# EAGLE design ARDUINO POWER UNIT1 (EAGLE 7.6.0)
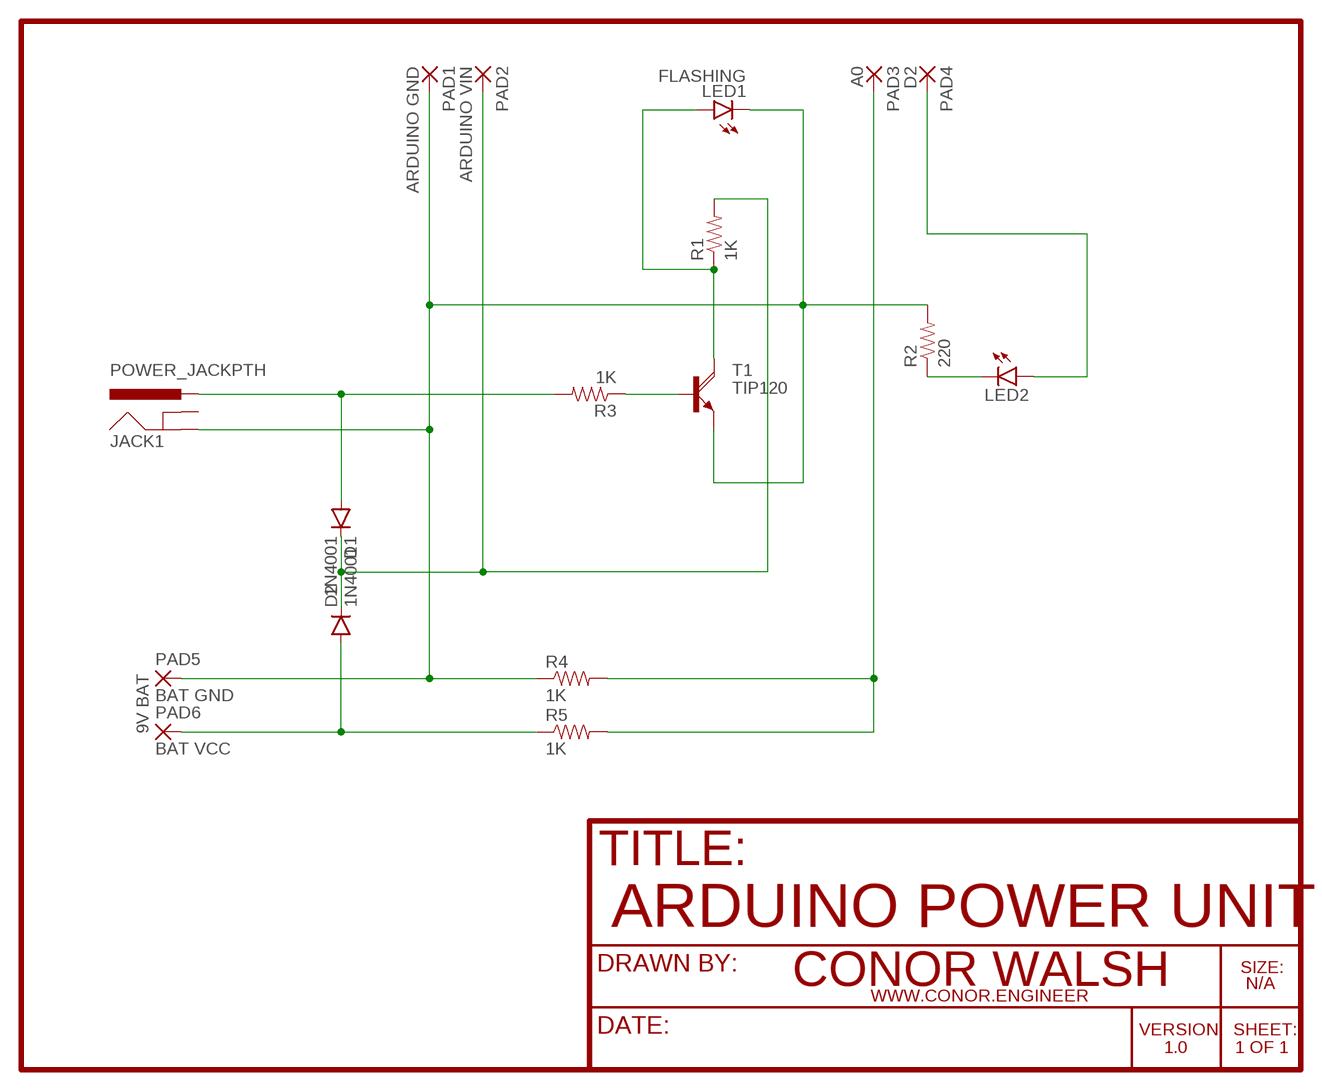
[diagram p0: schematic, sheet 1]

## Parts
D1  1N4001  DIODE1N4148  [DIODE-1N4148]
D2  1N4001  DIODE1N4148  [DIODE-1N4148]
JACK1  POWER_JACKPTH  [POWER_JACK_PTH]
LED1  FLASHING  LED5MM  [LED5MM]
LED2  LED5MM  [LED5MM]
PAD1  ARDUINO GND  2,54/0,9  [2,54/0,9]
PAD2  ARDUINO VIN  2,54/0,9  [2,54/0,9]
PAD3  A0  2,54/0,9  [2,54/0,9]
PAD4  D2  2,54/0,9  [2,54/0,9]
PAD5  BAT GND  2,54/0,9  [2,54/0,9]
PAD6  BAT VCC  2,54/0,9  [2,54/0,9]
R1  1K  RESISTORPTH-1/4W  [AXIAL-0.4]
R2  220  RESISTORPTH-1/4W  [AXIAL-0.4]
R3  1K  RESISTORPTH-1/4W  [AXIAL-0.4]
R4  1K  RESISTORPTH-1/4W  [AXIAL-0.4]
R5  1K  RESISTORPTH-1/4W  [AXIAL-0.4]
T1  TIP120  [TO220AH]

## Nets
N$1: D1.A JACK1.PWR R3.P$2
N$2: PAD3.1(P) R4.P$2 R5.P$2
N$3: R3.P$1 T1.B
N$4: LED1.A R1.P$1 T1.C
N$5: D2.A PAD6.1(P) R5.P$1
N$6: JACK1.GND LED1.K(C) PAD1.1(P) PAD5.1(P) R2.P$2 R4.P$1 T1.E
N$7: LED2.K(C) R2.P$1
N$8: LED2.A PAD4.1(P)
N$9: D1.C D2.C PAD2.1(P) R1.P$2
Unconnected: JACK1.GNDBREAK

## Notes on the sheet
- 9V BAT
- TITLE:
- ARDUINO POWER UNIT
- DRAWN BY: | SIZE:
- CONOR WALSH | N/A
- WWW.CONOR.ENGINEER
- DATE: | VERSION: | SHEET:
- 1.0 | 1 OF 1

## Library data of the parts
D1 D2 = SparkFun-DiscreteSemi:DIODE: Diode These are standard reverse protection diodes and small signal diodes. SMA package can handle up to about 1A. SOD-323 can handle about 200mA. What the SOD-323 package when ordering, there are some mfgs out there that are 5-pin packages.; PROD_ID: DIO-08378; VALUE: 1N4148
JACK1 = SparkFun-Connectors:POWER_JACK: Power Jack This is the standard 5.5mm barrel jack for power. The PTH is the most common, proven, reliable, footprint. The Slot footprint only works if the mill layer is transmitted to the PCB fab house so be warned. Mating wall wart : TOL-00298 (and others); PROD_ID: CONN-08197
LED1 LED2 = SparkFun-LED:LED: LEDs Standard schematic elements and footprints for 5mm, 3mm, 1206, and 0603 sized LEDs. 5mm - Spark Fun Electronics SKU : COM-00529 (and others)
PAD1-PAD6 = wirepad:2,54/0,9: THROUGH-HOLE PAD
R1-R5 = SparkFun-Resistors:RESISTOR: Resistor Basic schematic elements and footprints for 0603, 1206, and PTH resistors.
T1 = transistor-power:TIP120: NPN DARLINGTON TRANSISTOR

## Net classes
0 default: width 0.813 mm, clearance 0.813 mm

## Board
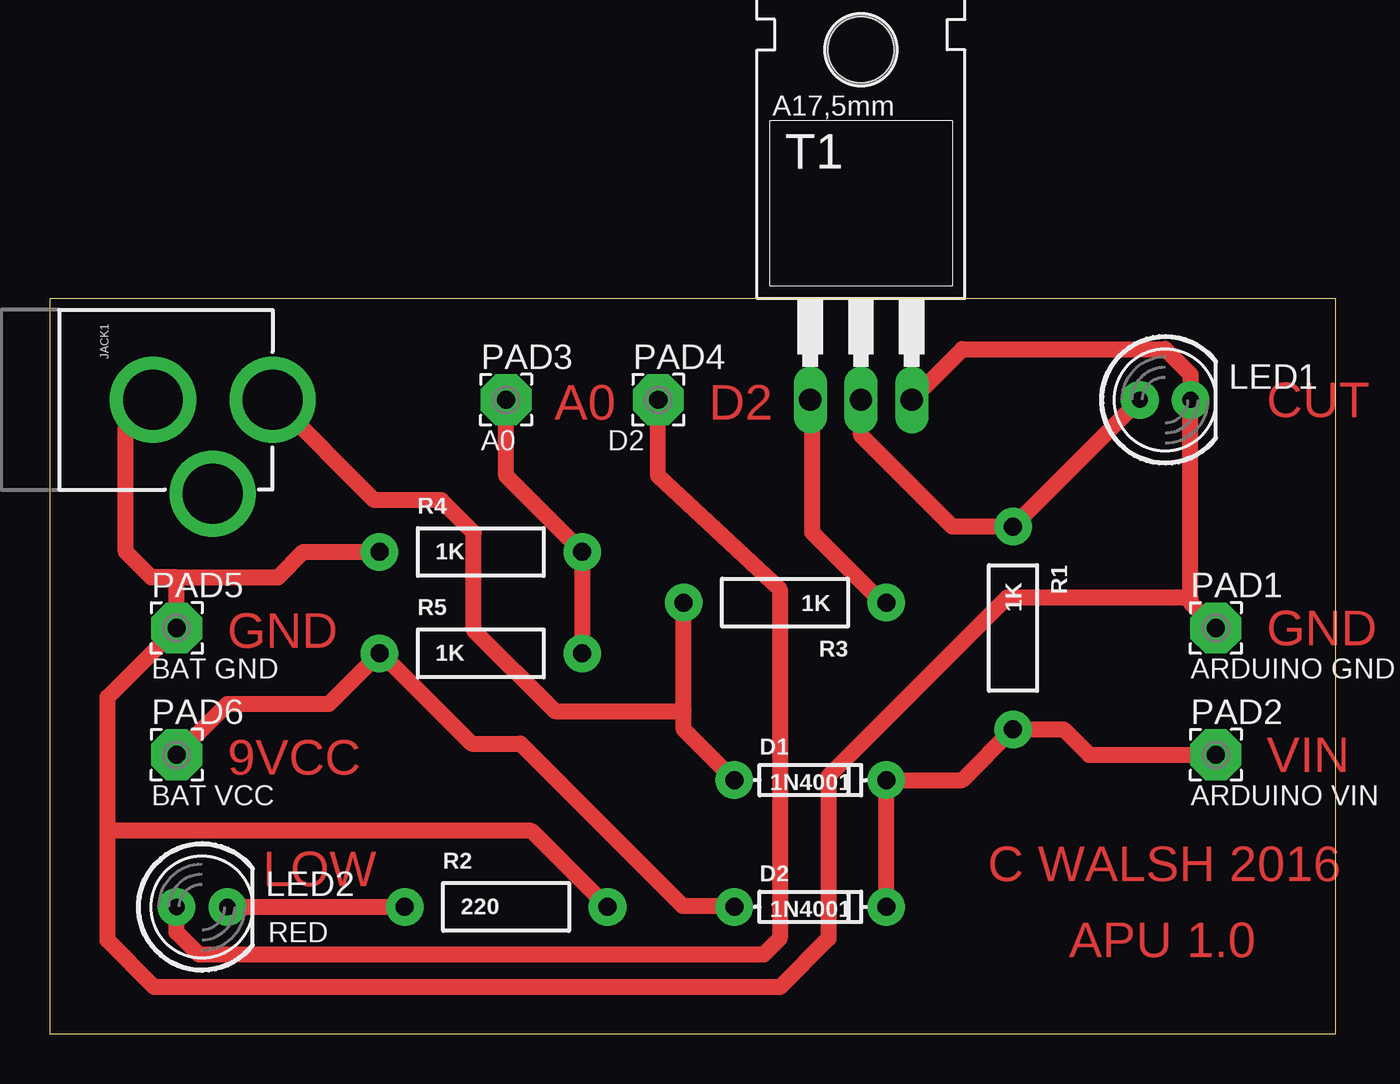
[diagram p1: board, top side]

Size 64.44 x 36.82 mm. Coordinates in mm from the lower left corner, seen from the top.
Outline: 0,0 64.44,0 64.44,36.82 0,36.82 0,0
Copper layers (1*16): Top 0.035mm / dielectric 1.5mm / Bottom 0.035mm
Design rules "default *": minimum track width 32mil, minimum drill 24mil, track to track 32mil, track to pad 32mil, pad to pad 10mil, via to via 10mil, smd to smd 32mil, copper to edge 32mil, drill to drill 8mil, minimum pad ring 10mil, minimum via ring 8mil, stop-mask expansion 4mil, vias tented up to drill 0mil, thermal gap 10mil

### Footprints (pad centres in the part's own frame; a part is rotated, then mirrored left to right if it is on the bottom)
DIODE-1N4148 = drill 0.9 pad 1.88: A -3.81,0; C 3.81,0
POWER_JACK_PTH = drill 2.997 pad 4.318: GND 0,7.7; GNDBREAK 4.7,10.7; PWR 0,13.7
LED5MM = drill 0.813 pad 1.88: A -1.27,0; K 1.27,0
2,54/0,9 = drill 0.914 pad 2.54 octagon: 1 0,0
AXIAL-0.4 = drill 0.9 pad 1.88: P$1 -5.08,0; P$2 5.08,0
TO220AH = drill 1.118 long: B -2.54,-6.35; C 0,-6.35; E 2.54,-6.35 | hole 3.302: 0,11.176

### Placement (x,y rotation side)
D1  38.1,12.7 0 top
D2  38.1,6.35 0 top
JACK1  -2.54,31.75 270 top
LED1  55.88,31.75 0 top
LED2  7.62,6.35 0 top
PAD1  58.42,20.32 0 top
PAD2  58.42,13.97 0 top
PAD3  22.86,31.75 0 top
PAD4  30.48,31.75 0 top
PAD5  6.35,20.32 0 top
PAD6  6.35,13.97 0 top
R1  48.26,20.32 270 top
R2  22.86,6.35 0 top
R3  36.83,21.59 180 top
R4  21.59,24.13 0 top
R5  21.59,19.05 0 top
T1  40.64,38.1 0 top

### Tracks (layer width: path | path; a pad name or v marks a point on that pad's centre or on a via)
N$1
  Top 0.813: D1.A 31.75,15.24 31.75,16.15 | 31.75,16.15 R3.P$2 | 31.75,16.15 25.3,16.15 21.23,20.22 21.23,25.1 19.61,26.72 16.26,26.72 11.38,31.6 JACK1.PWR
N$2
  Top 0.813: R5.P$2 R4.P$2 22.86,27.94 PAD3.1
N$3
  Top 0.813: T1.B 38.2,31.6 38.2,25.1 41.45,21.84 R3.P$1
N$4
  Top 0.813: T1.C 40.64,29.97 45.21,25.4 R1.P$1 LED1.A
N$5
  Top 0.813: D2.A 34.14,6.4 31.7,6.4 23.57,14.53 21.13,14.53 17.07,18.59 R5.P$1 13.97,16.51 8.89,16.51 PAD6.1
N$6
  Top 0.813: PAD1.1 57.15,21.59 57.15,21.84 | 57.15,21.84 LED1.K 57.15,33.02 55.88,34.29 45.72,34.29 T1.E | 57.15,21.84 47.95,21.84 39.01,12.9 39.01,4.77 36.58,2.34 5.23,2.34 2.9,4.67 2.9,10.16 | 6.35,22.86 PAD5.1 2.9,16.87 2.9,10.16 | 6.35,22.86 11.43,22.86 12.7,24.13 R4.P$1 | 6.35,22.86 5.08,22.86 3.81,24.13 3.81,30.4 JACK1.GND | R2.P$2 24.13,10.16 2.9,10.16
N$7
  Top 0.813: LED2.K R2.P$1
N$8
  Top 0.813: PAD4.1 30.48,27.94 36.58,22.25 36.58,4.77 35.76,3.96 7.47,3.96 6.35,5.08 LED2.A
N$9
  Top 0.813: D2.C D1.C 45.72,12.7 R1.P$2 50.8,15.24 52.07,13.97 PAD2.1

### Text on the board
Top: A0 | D2 | CUT | GND | GND | 9VCC | VIN | LOW | C WALSH 2016 | APU 1.0
tNames: A0 | D2 | BAT GND | ARDUINO GND | BAT VCC | ARDUINO VIN | RED